# EAGLE design Panel3 (EAGLE 8.2.0)
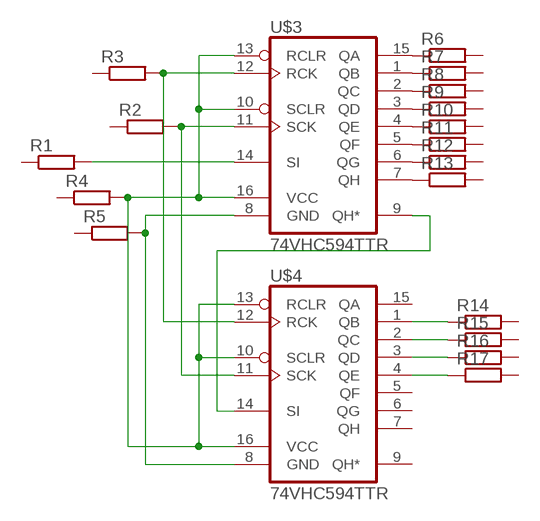
[diagram p0: schematic, sheet 1]

## Parts
R1  R_0805  [R0805]
R2  R_0805  [R0805]
R3  R_0805  [R0805]
R4  R_0805  [R0805]
R5  R_0805  [R0805]
R6  R_0805  [R0805]
R7  R_0805  [R0805]
R8  R_0805  [R0805]
R9  R_0805  [R0805]
R10  R_0805  [R0805]
R11  R_0805  [R0805]
R12  R_0805  [R0805]
R13  R_0805  [R0805]
R14  R_0805  [R0805]
R15  R_0805  [R0805]
R16  R_0805  [R0805]
R17  R_0805  [R0805]
U$3  74VHC594TTR  [TSSOP16]
U$4  74VHC594TTR  [TSSOP16]

## Nets
N$1: U$3.9(QH*) U$4.14(SI)
N$2: R4.2 U$3.10(SCLR) U$3.13(RCLR) U$3.16(VCC) U$4.10(SCLR) U$4.13(RCLR) U$4.16(VCC)
N$3: R6.1 U$3.15(QA)
N$4: R2.2 U$3.11(SCK) U$4.11(SCK)
N$5: R7.1 U$3.1(QB)
N$6: R3.2 U$3.12(RCK) U$4.12(RCK)
N$7: R1.2 U$3.14(SI)
N$8: R8.1 U$3.2(QC)
N$9: R5.2 U$3.8(GND) U$4.8(GND)
N$10: R9.1 U$3.3(QD)
N$11: R10.1 U$3.4(QE)
N$12: R11.1 U$3.5(QF)
N$13: R12.1 U$3.6(QG)
N$14: R13.1 U$3.7(QH)
N$15: R14.1 U$4.1(QB)
N$16: R15.1 U$4.2(QC)
N$17: R16.1 U$4.3(QD)
N$18: R17.1 U$4.4(QE)
Unconnected: R1.1 R2.1 R3.1 R4.1 R5.1 R6.2 R7.2 R8.2 R9.2 R10.2 R11.2 R12.2 R13.2 R14.2 R15.2 R16.2 R17.2 U$4.5(QF) U$4.6(QG) U$4.7(QH) U$4.9(QH*) U$4.15(QA)

## Library data of the parts
R1-R17 = Namenlos:R_
U$3 U$4 = Namenlos:74VHC594TTR

## Board
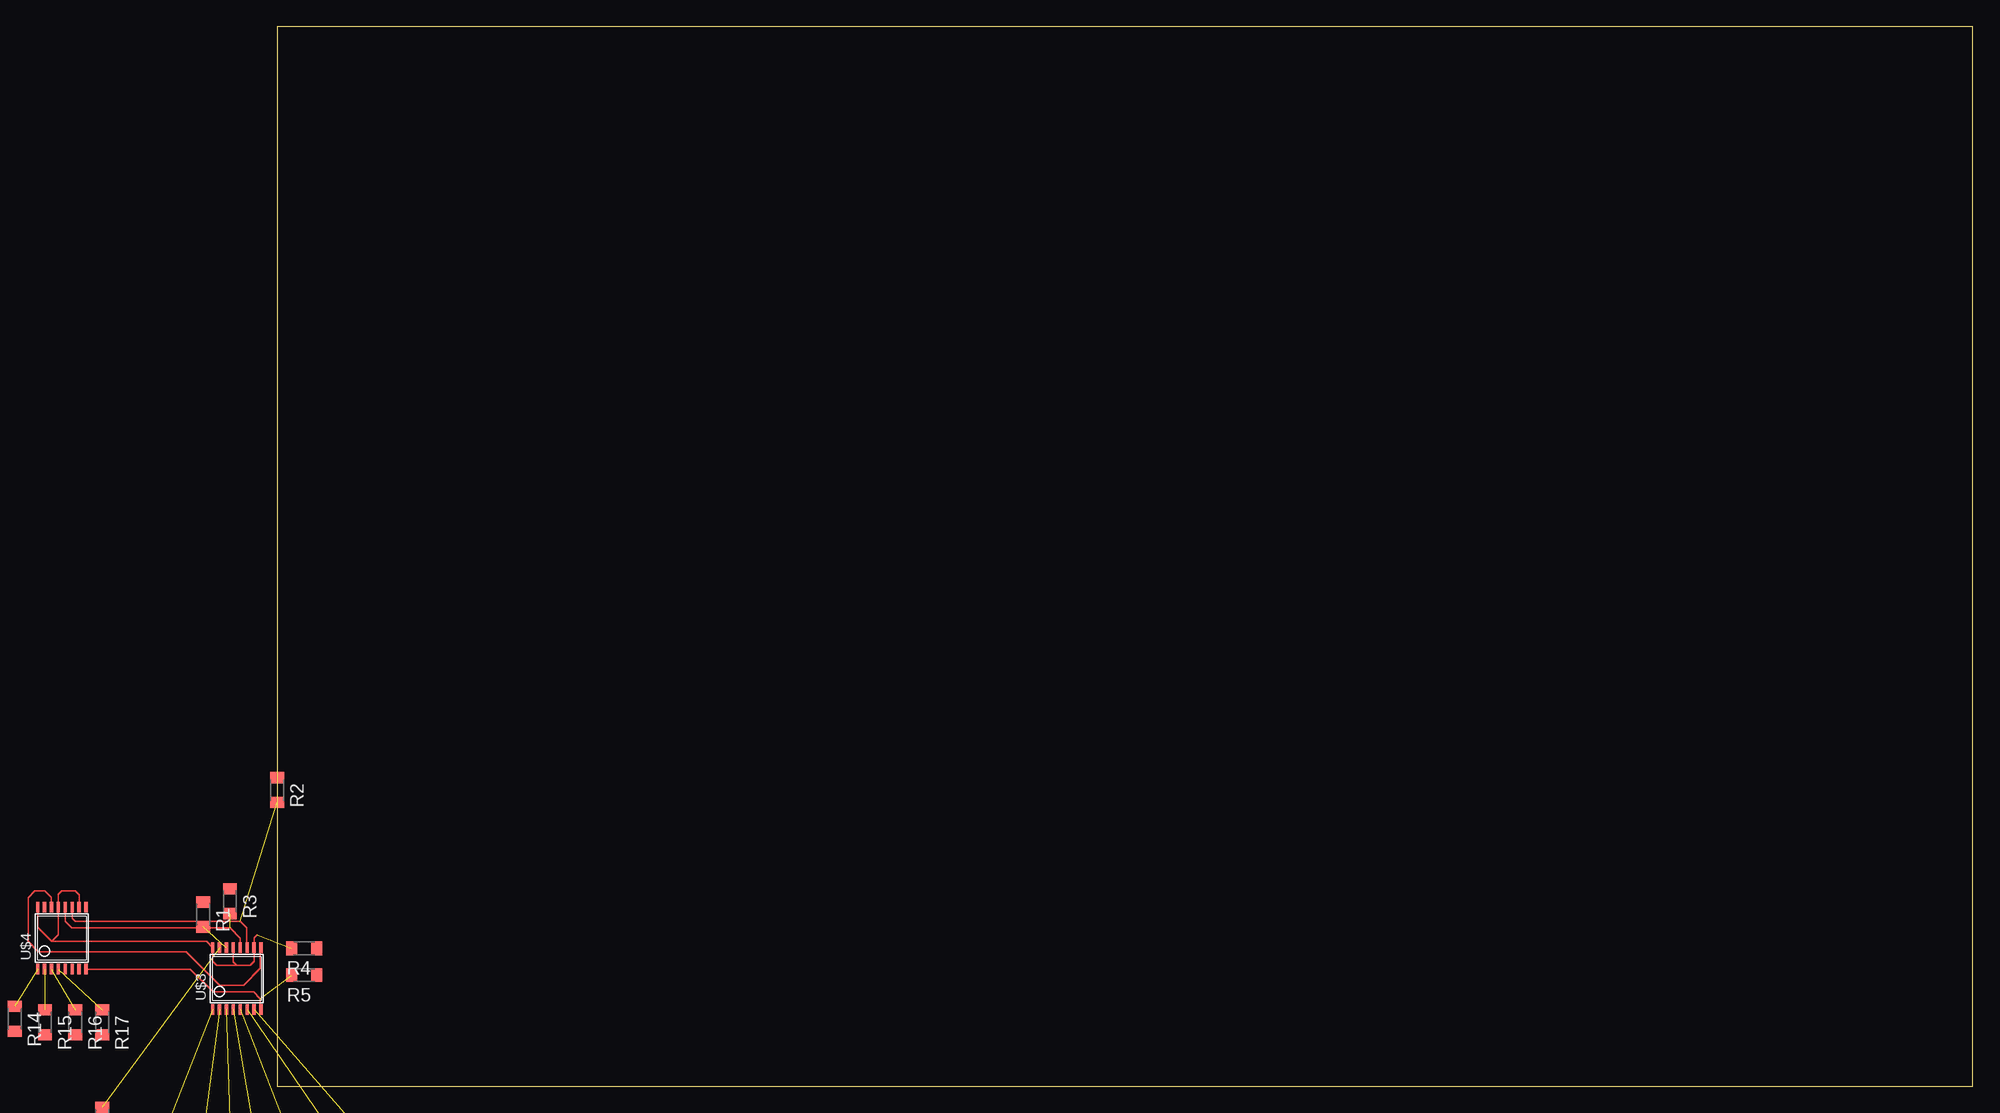
[diagram p1: board, top side]

Size 160 x 100 mm. Coordinates in mm from the lower left corner, seen from the top.
Outline: 0,0 160,0 160,100 0,100 0,0
Copper layers (1*16): Top 0.035mm / dielectric 1.5mm / Bottom 0.035mm
Design rules "default": minimum track width 6mil, minimum drill 0.35mm, track to track 6mil, track to pad 6mil, pad to pad 6mil, via to via 6mil, smd to smd 6mil, copper to edge 40mil, drill to drill 6mil, minimum pad ring 10mil, minimum via ring 8mil, stop-mask expansion 4mil, vias tented up to drill 0mil, thermal gap 10mil

### Footprints (pad centres in the part's own frame; a part is rotated, then mirrored left to right if it is on the bottom)
R0805 = smd 1.05 x 1.3: 1 -1.175,0; 2 1.175,0
TSSOP16 = smd 0.305 x 0.991: 1 -2.275,-2.918; 2 -1.625,-2.918; 3 -0.975,-2.918; 4 -0.325,-2.918; 5 0.325,-2.918; 6 0.975,-2.918; 7 1.625,-2.918; 8 2.275,-2.918; 9 2.275,2.918; 10 1.625,2.918; 11 0.975,2.918; 12 0.325,2.918; 13 -0.325,2.918; 14 -0.975,2.918; 15 -1.625,2.918; 16 -2.275,2.918

### Placement (x,y rotation side)
R1  -6.99,16.19 270 top  (outside the outline)
R2  0,27.94 270 top
R3  -4.45,17.46 270 top  (outside the outline)
R4  2.54,13.02 180 top
R5  2.54,10.48 180 top
R6  -16.51,-3.17 270 top  (outside the outline)
R7  -10.48,-5.08 270 top  (outside the outline)
R8  -6.99,-5.71 270 top  (outside the outline)
R9  -4.45,-5.71 270 top  (outside the outline)
R10  -2.22,-5.4 270 top  (outside the outline)
R11  0.95,-5.4 270 top  (outside the outline)
R12  5.71,-6.35 270 top  (outside the outline)
R13  9.21,-6.99 270 top  (outside the outline)
R14  -24.77,6.35 270 top  (outside the outline)
R15  -21.91,6.03 270 top  (outside the outline)
R16  -19.05,6.03 270 top  (outside the outline)
R17  -16.51,6.03 270 top  (outside the outline)
U$3  -3.81,10.16 0 top
U$4  -20.32,13.97 0 top  (outside the outline)

### Tracks (layer width: path | path; a pad name or v marks a point on that pad's centre or on a via)
N$1
  Top 0.152: U$4.14 -21.3,17.8 -21.91,18.41 -22.86,18.41 -23.5,17.78 -23.5,13.65 -22.54,12.7 -8.57,12.7 -5.4,9.53 -3.17,9.53 -1.59,11.11 -1.59,13.03 U$3.9
N$2  (1 unrouted)
  Top 0.152: U$4.16 -22.59,14.97 -21.27,13.65 | -21.27,13.65 -6.66,13.65 U$3.16 -6.08,11.8 -5.71,11.43 -3.81,11.43 | -21.27,13.65 -20.64,14.28 -20.64,15.56 U$4.13 -20.64,18.1 -20.32,18.41 -19.05,18.41 -18.7,18.06 U$4.10 | -3.81,11.43 -2.54,11.43 -2.19,11.79 U$3.10 -2.19,14.01 -1.91,14.29 | -3.81,11.43 -4.13,11.75 U$3.13
N$3  (1 unrouted)
N$4  (1 unrouted)
  Top 0.152: U$4.11 -19.34,15.85 -19.05,15.56 -3.49,15.56 -2.86,14.92 -2.86,13.1 U$3.11
N$5  (1 unrouted)
N$6  (1 unrouted)
  Top 0.152: U$4.12 -20,15.55 -19.37,14.92 -4.45,14.92 -3.49,13.97 -3.49,13.09 U$3.12
N$7  (1 unrouted)
N$8  (1 unrouted)
N$9  (1 unrouted)
  Top 0.152: U$4.8 -8.2,11.05 -6.03,8.89 -2.22,8.89 -1.59,8.26 -1.59,7.29 U$3.8
N$10  (1 unrouted)
N$11  (1 unrouted)
N$12  (1 unrouted)
N$13  (1 unrouted)
N$14  (1 unrouted)
N$15  (1 unrouted)
N$16  (1 unrouted)
N$17  (1 unrouted)
N$18  (1 unrouted)